# EAGLE schematic BPB_FM1 (EAGLE 9.6.2)
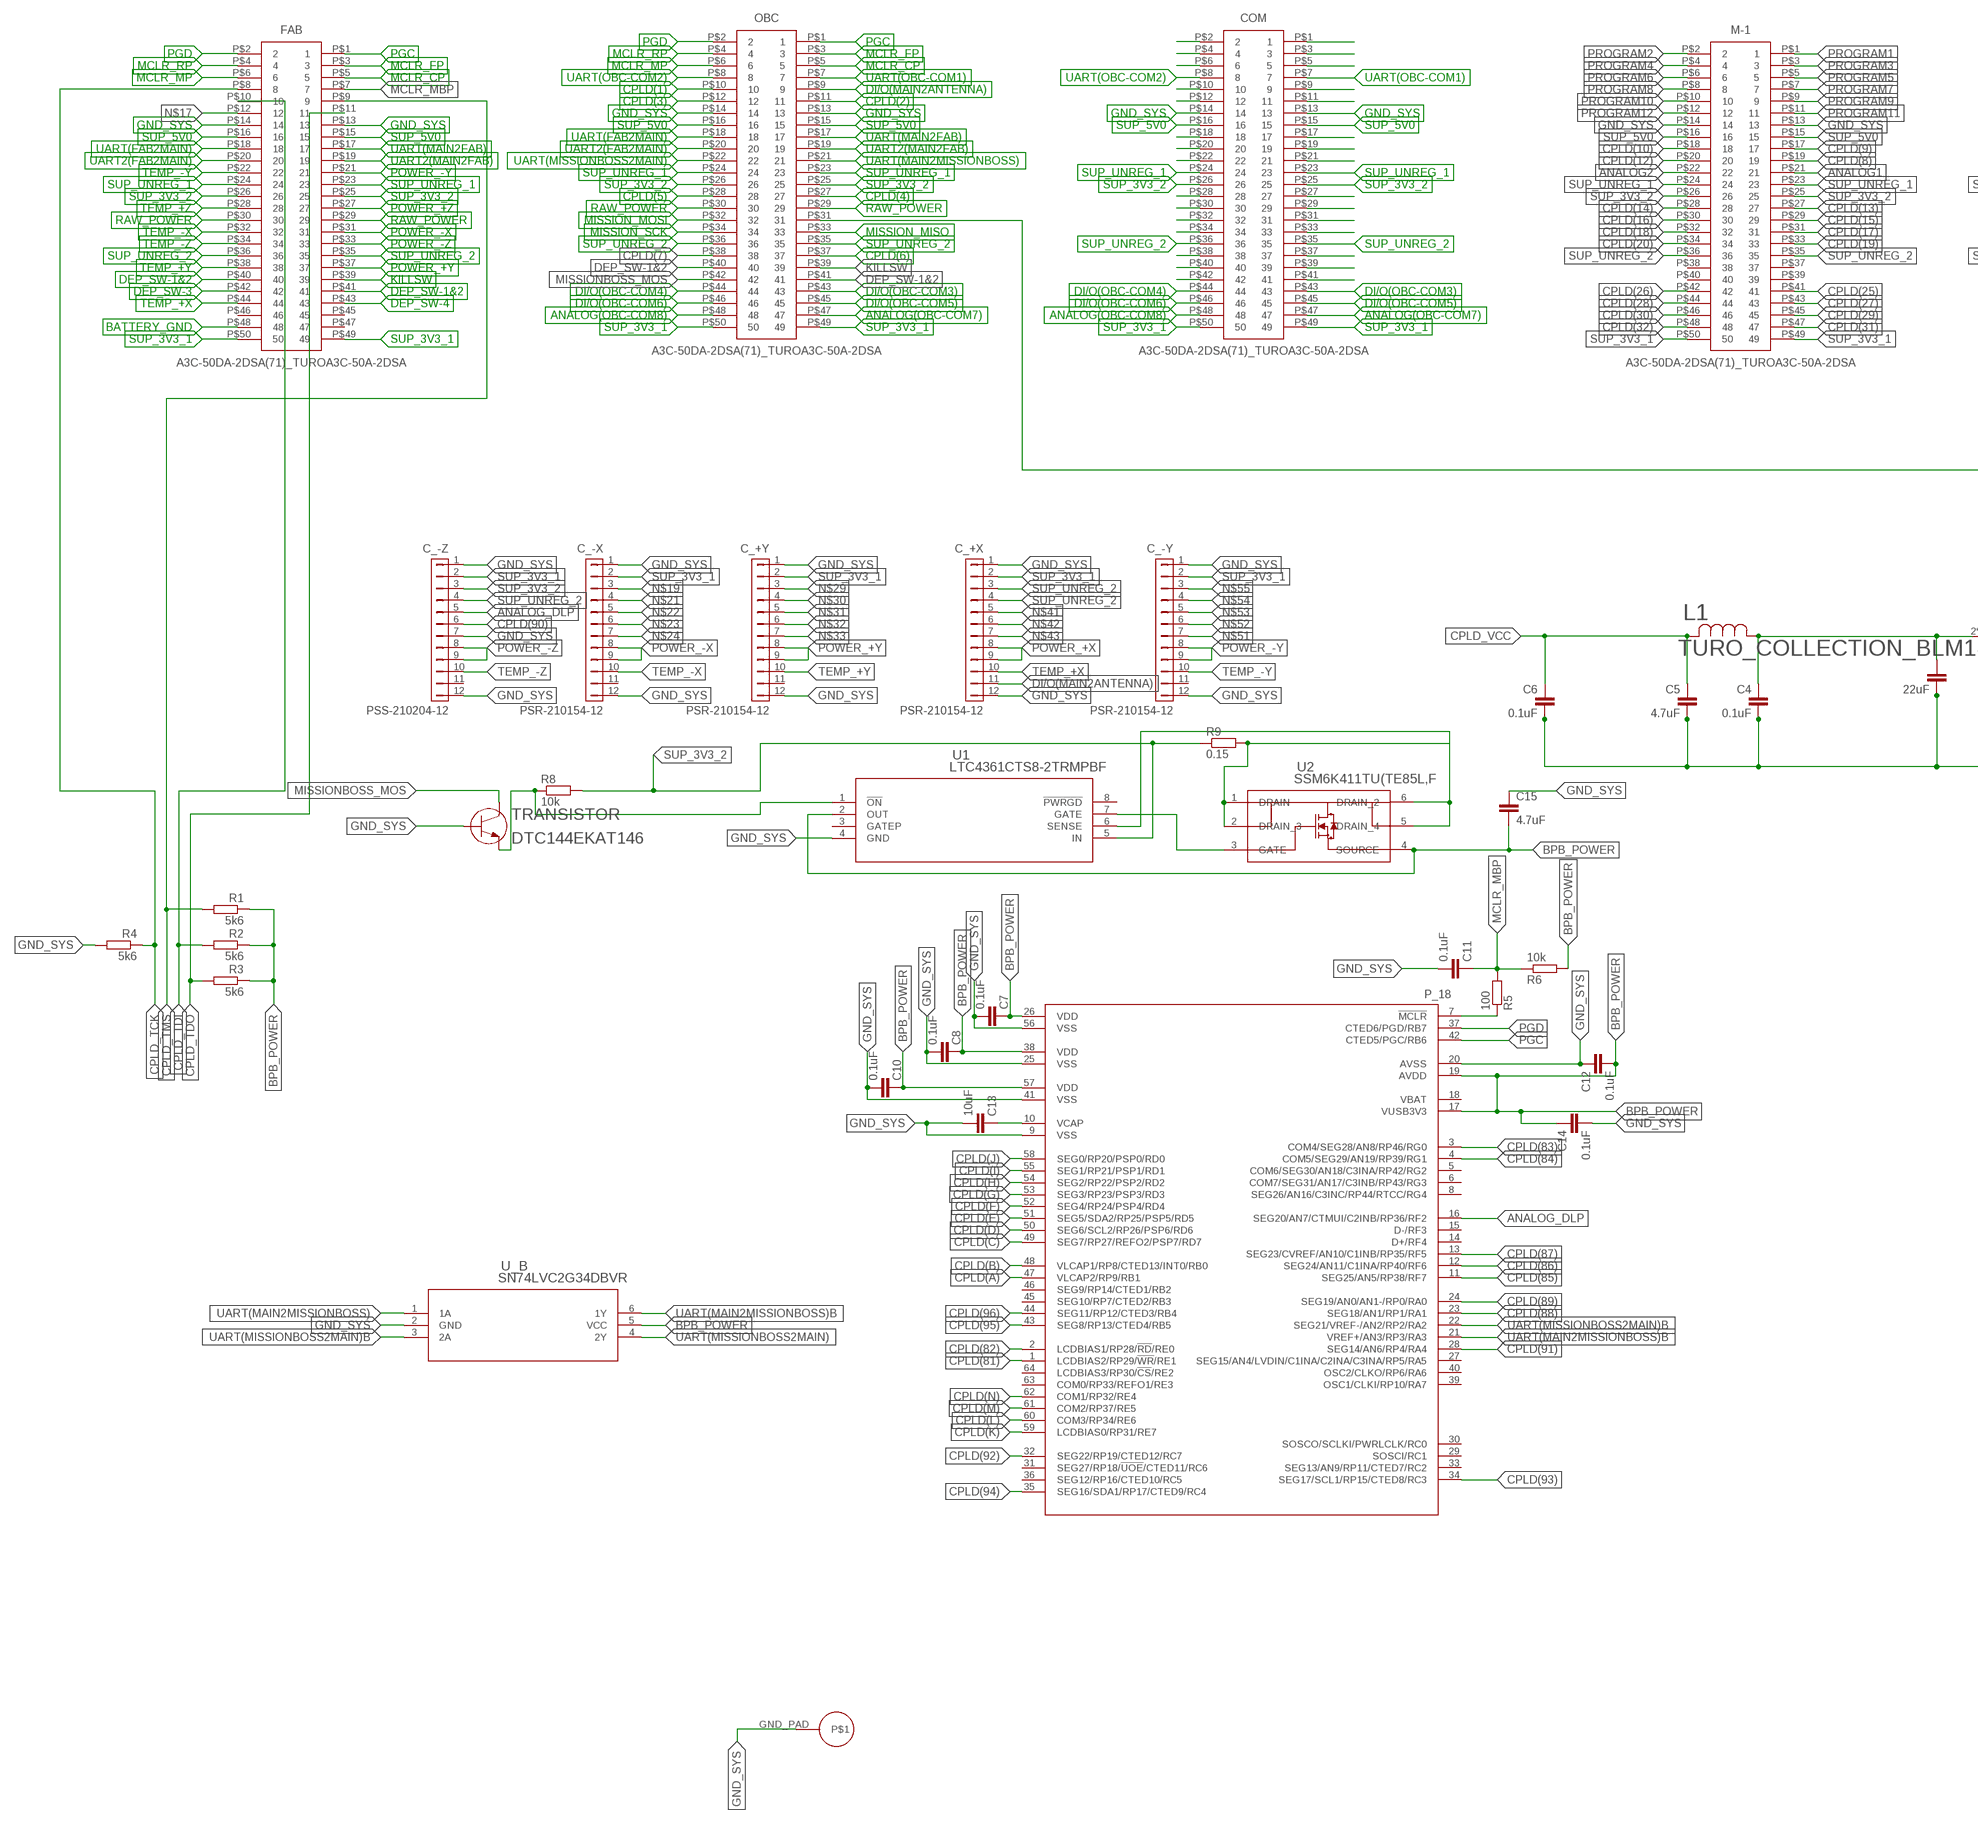
[diagram p0: schematic, sheet 1, part 1 of 2]
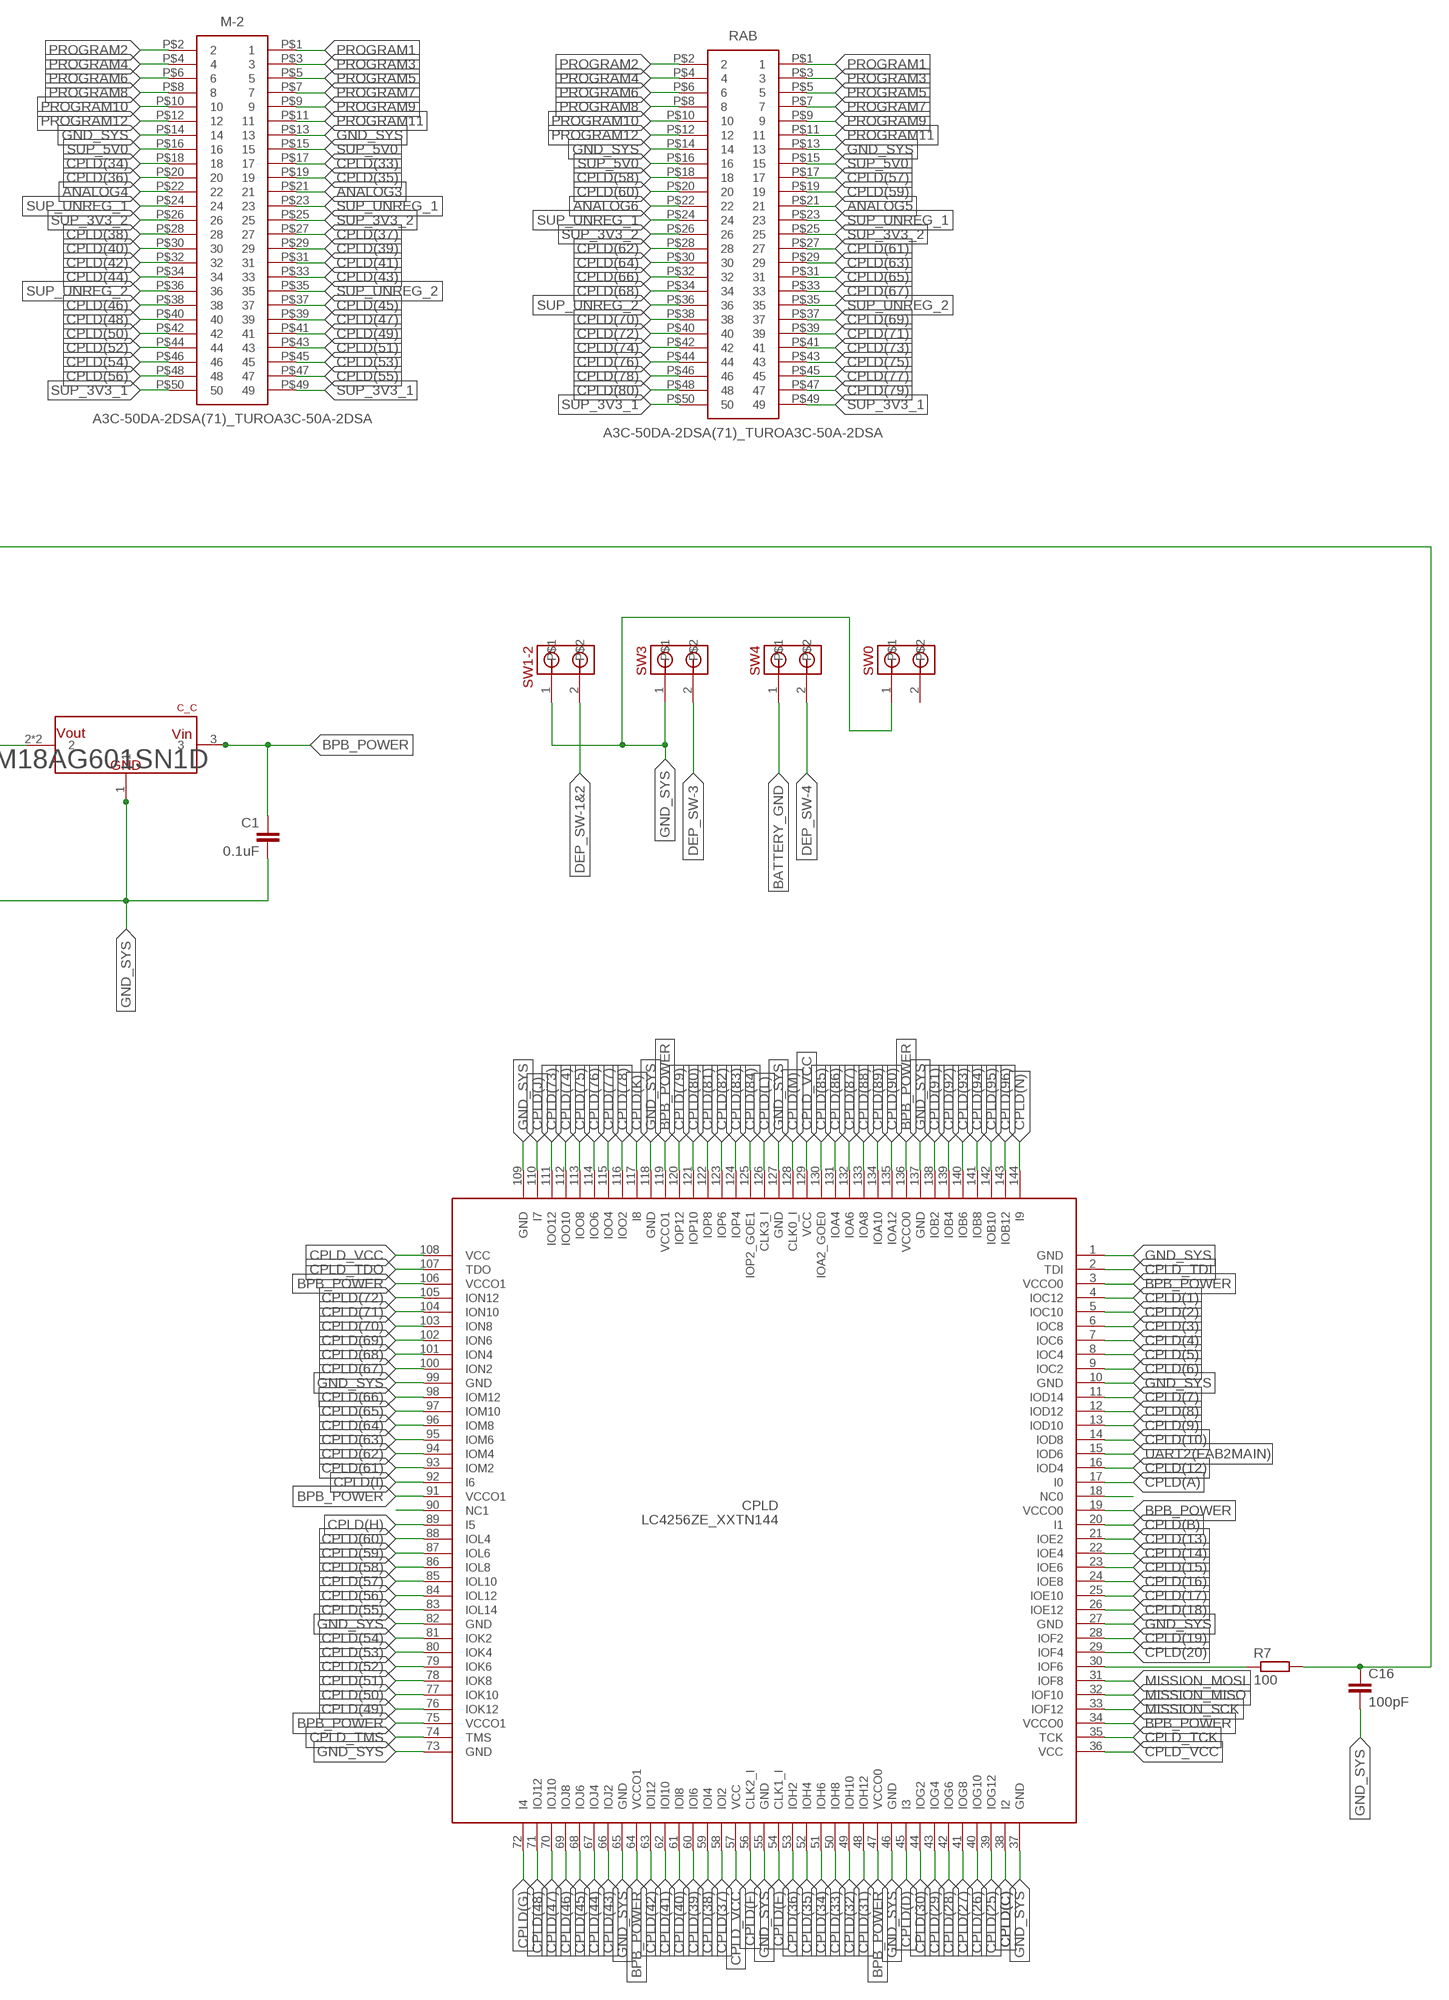
[diagram p1: schematic, sheet 1, part 2 of 2]

## Parts
C1  0.1uF  CC0402  [C0402]
C3  22uF  CC2012  [C2012]
C4  0.1uF  CC0402  [C0402]
C5  4.7uF  CC2012  [C2012]
C6  0.1uF  CC0402  [C0402]
C7  0.1uF  CC0402  [C0402]
C8  0.1uF  CC0402  [C0402]
C10  0.1uF  CC0402  [C0402]
C11  0.1uF  CC0402  [C0402]
C12  0.1uF  CC0402  [C0402]
C13  10uF  CC0402  [C0402]
C14  0.1uF  CC0402  [C0402]
C15  4.7uF  CC0402  [C0402]
C16  100pF  CC0402  [C0402]
C_+X  PSR-210154-12  [PIN1X12/90]
C_+Y  PSR-210154-12  [PIN1X12/90]
C_-X  PSR-210154-12  [PIN1X12/90]
C_-Y  PSR-210154-12  [PIN1X12/90]
C_-Z  PSS-210204-12  [PIN1X12]
C_C  NCV1117ST18T3G  [SOT223]
COM  A3C-50DA-2DSA(71)_TUROA3C-50A-2DSA  [SHDR50W60P200_2X25_5000X400X44_TR]
CPLD  LC4256ZE_XXTN144  [TQFP144]
FAB  A3C-50DA-2DSA(71)_TUROA3C-50A-2DSA  [SHDR50W60P200_2X25_5000X400X44_TR]
L1  TURO_COLLECTION_BLM18AG601SN1D  [TURO_COLLECTION_IND_BLM18_0603]
M-1  A3C-50DA-2DSA(71)_TUROA3C-50A-2DSA  [SHDR50W60P200_2X25_5000X400X44_TR]
M-2  A3C-50DA-2DSA(71)_TUROA3C-50A-2DSA  [SHDR50W60P200_2X25_5000X400X44_TR]
OBC  A3C-50DA-2DSA(71)_TUROA3C-50A-2DSA  [SHDR50W60P200_2X25_5000X400X44_TR]
P_18  PIC18F67J94  [PIC18F67J9_SMA_LEAD]
R1  5k6  RR0402  [R0402]
R2  5k6  RR0402  [R0402]
R3  5k6  RR0402  [R0402]
R4  5k6  RR0402  [R0402]
R5  100  RR0402  [R0402]
R6  10k  RR0402  [R0402]
R7  100  RR0402  [R0402]
R8  10k  RR0402  [R0402]
R9  0.15  RR0402  [R0402]
RAB  A3C-50DA-2DSA(71)_TUROA3C-50A-2DSA  [SHDR50W60P200_2X25_5000X400X44_TR]
SW0  MOLEX-CONN-2-0554600272  [MOLEX-CONN-2-BIRDS]
SW1-2  MOLEX-CONN-2-0554600272  [MOLEX-CONN-2-BIRDS]
SW3  MOLEX-CONN-2-0554600272  [MOLEX-CONN-2-BIRDS]
SW4  MOLEX-CONN-2-0554600272  [MOLEX-CONN-2-BIRDS]
TRANSISTOR  DTC144EKAT146  [TRANS_DTA113TKAT_ROM]
U1  LTC4361CTS8-2TRMPBF  [TSOT-23_TS8_LIT]
U2  SSM6K411TU(TE85L,F  [SON_E85L,F_TOS]
U$1  GND_PAD  [GND_PAD]
U_B  SN74LVC2G34DBVR  [DBV6]

## Nets
ANALOG1: M-1.P$21
ANALOG2: M-1.P$22
ANALOG3: M-2.P$21
ANALOG4: M-2.P$22
ANALOG5: RAB.P$21
ANALOG6: RAB.P$22
ANALOG(OBC-COM7): COM.P$47 OBC.P$47
ANALOG(OBC-COM8): COM.P$48 OBC.P$48
ANALOG_DLP: C_-Z.5 P_18.16(SEG20/AN7/CTMUI/C2INB/RP36/RF2)
BATTERY_GND: FAB.P$48 SW4.1
BPB_POWER: C1.1 C7.1 C8.1 C10.1 C12.2 C14.1 C15.2 C_C.3 CPLD.3(VCCO0) CPLD.19(VCCO0) CPLD.34(VCCO0) CPLD.47(VCCO0) CPLD.64(VCCO1) CPLD.75(VCCO1) CPLD.91(VCCO1) CPLD.106(VCCO1) CPLD.119(VCCO1) CPLD.136(VCCO0) P_18.17(VUSB3V3) P_18.19(AVDD) P_18.26(VDD) P_18.38(VDD) P_18.57(VDD) R1.1 R2.1 R3.1 R6.2 U1.2(OUT) U2.4(SOURCE) U_B.5(VCC)
CPLD(1): CPLD.4(IOC12) OBC.P$10
CPLD(2): CPLD.5(IOC10) OBC.P$11
CPLD(3): CPLD.6(IOC8) OBC.P$12
CPLD(4): CPLD.7(IOC6) OBC.P$27
CPLD(5): CPLD.8(IOC4) OBC.P$28
CPLD(6): CPLD.9(IOC2) OBC.P$37
CPLD(7): CPLD.11(IOD14) OBC.P$38
CPLD(8): CPLD.12(IOD12) M-1.P$19
CPLD(9): CPLD.13(IOD10) M-1.P$17
CPLD(10): CPLD.14(IOD8) M-1.P$18
CPLD(12): CPLD.16(IOD4) M-1.P$20
CPLD(13): CPLD.21(IOE2) M-1.P$27
CPLD(14): CPLD.22(IOE4) M-1.P$28
CPLD(15): CPLD.23(IOE6) M-1.P$29
CPLD(16): CPLD.24(IOE8) M-1.P$30
CPLD(17): CPLD.25(IOE10) M-1.P$31
CPLD(18): CPLD.26(IOE12) M-1.P$32
CPLD(19): CPLD.28(IOF2) M-1.P$33
CPLD(20): CPLD.29(IOF4) M-1.P$34
CPLD(25): CPLD.39(IOG12) M-1.P$41
CPLD(26): CPLD.40(IOG10) M-1.P$42
CPLD(27): CPLD.41(IOG8) M-1.P$43
CPLD(28): CPLD.42(IOG6) M-1.P$44
CPLD(29): CPLD.43(IOG4) M-1.P$45
CPLD(30): CPLD.44(IOG2) M-1.P$46
CPLD(31): CPLD.48(IOH12) M-1.P$47
CPLD(32): CPLD.49(IOH10) M-1.P$48
CPLD(33): CPLD.50(IOH8) M-2.P$17
CPLD(34): CPLD.51(IOH6) M-2.P$18
CPLD(35): CPLD.52(IOH4) M-2.P$19
CPLD(36): CPLD.53(IOH2) M-2.P$20
CPLD(37): CPLD.58(IOI2) M-2.P$27
CPLD(38): CPLD.59(IOI4) M-2.P$28
CPLD(39): CPLD.60(IOI6) M-2.P$29
CPLD(40): CPLD.61(IOI8) M-2.P$30
CPLD(41): CPLD.62(IOI10) M-2.P$31
CPLD(42): CPLD.63(IOI12) M-2.P$32
CPLD(43): CPLD.66(IOJ2) M-2.P$33
CPLD(44): CPLD.67(IOJ4) M-2.P$34
CPLD(45): CPLD.68(IOJ6) M-2.P$37
CPLD(46): CPLD.69(IOJ8) M-2.P$38
CPLD(47): CPLD.70(IOJ10) M-2.P$39
CPLD(48): CPLD.71(IOJ12) M-2.P$40
CPLD(49): CPLD.76(IOK12) M-2.P$41
CPLD(50): CPLD.77(IOK10) M-2.P$42
CPLD(51): CPLD.78(IOK8) M-2.P$43
CPLD(52): CPLD.79(IOK6) M-2.P$44
CPLD(53): CPLD.80(IOK4) M-2.P$45
CPLD(54): CPLD.81(IOK2) M-2.P$46
CPLD(55): CPLD.83(IOL14) M-2.P$47
CPLD(56): CPLD.84(IOL12) M-2.P$48
CPLD(57): CPLD.85(IOL10) RAB.P$17
CPLD(58): CPLD.86(IOL8) RAB.P$18
CPLD(59): CPLD.87(IOL6) RAB.P$19
CPLD(60): CPLD.88(IOL4) RAB.P$20
CPLD(61): CPLD.93(IOM2) RAB.P$27
CPLD(62): CPLD.94(IOM4) RAB.P$28
CPLD(63): CPLD.95(IOM6) RAB.P$29
CPLD(64): CPLD.96(IOM8) RAB.P$30
CPLD(65): CPLD.97(IOM10) RAB.P$31
CPLD(66): CPLD.98(IOM12) RAB.P$32
CPLD(67): CPLD.100(ION2) RAB.P$33
CPLD(68): CPLD.101(ION4) RAB.P$34
CPLD(69): CPLD.102(ION6) RAB.P$37
CPLD(70): CPLD.103(ION8) RAB.P$38
CPLD(71): CPLD.104(ION10) RAB.P$39
CPLD(72): CPLD.105(ION12) RAB.P$40
CPLD(73): CPLD.111(IOO12) RAB.P$41
CPLD(74): CPLD.112(IOO10) RAB.P$42
CPLD(75): CPLD.113(IOO8) RAB.P$43
CPLD(76): CPLD.114(IOO6) RAB.P$44
CPLD(77): CPLD.115(IOO4) RAB.P$45
CPLD(78): CPLD.116(IOO2) RAB.P$46
CPLD(79): CPLD.120(IOP12) RAB.P$47
CPLD(80): CPLD.121(IOP10) RAB.P$48
CPLD(81): CPLD.122(IOP8) P_18.1(LCDBIAS2/RP29/!WR!/RE1)
CPLD(82): CPLD.123(IOP6) P_18.2(LCDBIAS1/RP28/!RD!/RE0)
CPLD(83): CPLD.124(IOP4) P_18.3(COM4/SEG28/AN8/RP46/RG0)
CPLD(84): CPLD.125(IOP2_GOE1) P_18.4(COM5/SEG29/AN19/RP39/RG1)
CPLD(85): CPLD.130(IOA2_GOE0) P_18.11(SEG25/AN5/RP38/RF7)
CPLD(86): CPLD.131(IOA4) P_18.12(SEG24/AN11/C1INA/RP40/RF6)
CPLD(87): CPLD.132(IOA6) P_18.13(SEG23/CVREF/AN10/C1INB/RP35/RF5)
CPLD(88): CPLD.133(IOA8) P_18.23(SEG18/AN1/RP1/RA1)
CPLD(89): CPLD.134(IOA10) P_18.24(SEG19/AN0/AN1-/RP0/RA0)
CPLD(90): C_-Z.6 CPLD.135(IOA12)
CPLD(91): CPLD.138(IOB2) P_18.28(SEG14/AN6/RP4/RA4)
CPLD(92): CPLD.139(IOB4) P_18.32(SEG22/RP19/CTED12/RC7)
CPLD(93): CPLD.140(IOB6) P_18.34(SEG17/SCL1/RP15/CTED8/RC3)
CPLD(94): CPLD.141(IOB8) P_18.35(SEG16/SDA1/RP17/CTED9/RC4)
CPLD(95): CPLD.142(IOB10) P_18.43(SEG8/RP13/CTED4/RB5)
CPLD(96): CPLD.143(IOB12) P_18.44(SEG11/RP12/CTED3/RB4)
CPLD(A): CPLD.17(I0) P_18.47(VLCAP2/RP9/RB1)
CPLD(B): CPLD.20(I1) P_18.48(VLCAP1/RP8/CTED13/INT0/RB0)
CPLD(C): CPLD.38(I2) P_18.49(SEG7/RP27/REFO2/PSP7/RD7)
CPLD(D): CPLD.45(I3) P_18.50(SEG6/SCL2/RP26/PSP6/RD6)
CPLD(E): CPLD.54(CLK1_I) P_18.51(SEG5/SDA2/RP25/PSP5/RD5)
CPLD(F): CPLD.56(CLK2_I) P_18.52(SEG4/RP24/PSP4/RD4)
CPLD(G): CPLD.72(I4) P_18.53(SEG3/RP23/PSP3/RD3)
CPLD(H): CPLD.89(I5) P_18.54(SEG2/RP22/PSP2/RD2)
CPLD(I): CPLD.92(I6) P_18.55(SEG1/RP21/PSP1/RD1)
CPLD(J): CPLD.110(I7) P_18.58(SEG0/RP20/PSP0/RD0)
CPLD(K): CPLD.117(I8) P_18.59(LCDBIAS0/RP31/RE7)
CPLD(L): CPLD.126(CLK3_I) P_18.60(COM3/RP34/RE6)
CPLD(M): CPLD.128(CLK0_I) P_18.61(COM2/RP37/RE5)
CPLD(N): CPLD.144(I9) P_18.62(COM1/RP32/RE4)
CPLD_TCK: CPLD.35(TCK) FAB.P$8 R4.1
CPLD_TDI: CPLD.2(TDI) FAB.P$10 R2.2
CPLD_TDO: CPLD.107(TDO) FAB.P$11 R3.2
CPLD_TMS: CPLD.74(TMS) FAB.P$9 R1.2
CPLD_VCC: C5.1 C6.1 CPLD.36(VCC) CPLD.57(VCC) CPLD.108(VCC) CPLD.129(VCC) L1.2
DEP_SW-1&2: FAB.P$40 FAB.P$41 OBC.P$40 OBC.P$41 SW1-2.2
DEP_SW-3: FAB.P$42 SW3.2
DEP_SW-4: FAB.P$43 SW4.2
DI/O(MAIN2ANTENNA): C_+X.11 OBC.P$9
DI/O(OBC-COM3): COM.P$43 OBC.P$43
DI/O(OBC-COM4): COM.P$44 OBC.P$44
DI/O(OBC-COM5): COM.P$45 OBC.P$45
DI/O(OBC-COM6): COM.P$46 OBC.P$46
GND_SYS: C1.2 C3.2 C4.2 C5.2 C6.2 C7.2 C8.2 C10.2 C11.2 C12.1 C13.2 C14.2 C15.1 C16.2 C_+X.1 C_+X.12 C_+Y.1 C_+Y.12 C_-X.1 C_-X.12 C_-Y.1 C_-Y.12 C_-Z.1 C_-Z.7 C_-Z.12 C_C.1 COM.P$13 COM.P$14 CPLD.1(GND) CPLD.10(GND) CPLD.27(GND) CPLD.37(GND) CPLD.46(GND) CPLD.55(GND) CPLD.65(GND) CPLD.73(GND) CPLD.82(GND) CPLD.99(GND) CPLD.109(GND) CPLD.118(GND) CPLD.127(GND) CPLD.137(GND) FAB.P$13 FAB.P$14 M-1.P$13 M-1.P$14 M-2.P$13 M-2.P$14 OBC.P$13 OBC.P$14 P_18.9(VSS) P_18.20(AVSS) P_18.25(VSS) P_18.41(VSS) P_18.56(VSS) R4.2 RAB.P$13 RAB.P$14 SW0.1 SW1-2.1 SW3.1 TRANSISTOR.2 U1.4(GND) U$1.GND_PAD U_B.2(GND)
KILLSW: FAB.P$39 OBC.P$39
MCLR_CP: FAB.P$5 OBC.P$5
MCLR_FP: FAB.P$3 OBC.P$3
MCLR_MBP: C11.1 FAB.P$7 R5.2 R6.1
MCLR_MP: FAB.P$6 OBC.P$6
MCLR_RP: FAB.P$4 OBC.P$4
MISSION_CS: C16.1 OBC.P$31 R7.2
MISSION_MISO: CPLD.32(IOF10) OBC.P$33
MISSION_MOSI: CPLD.31(IOF8) OBC.P$32
MISSION_SCK: CPLD.33(IOF12) OBC.P$34
MISSIONBOSS_MOS: OBC.P$42 TRANSISTOR.1
N$1: P_18.7(!MCLR!) R5.1
N$2: CPLD.30(IOF6) R7.1
N$3: R8.1 TRANSISTOR.3 U1.1(!ON)
N$5: R9.2 U1.6(SENSE) U2.1(DRAIN) U2.2(DRAIN_3) U2.5(DRAIN_4) U2.6(DRAIN_2)
N$6: C13.1 P_18.10(VCAP)
N$9: U1.7(GATE) U2.3(GATE)
N$17: FAB.P$12
N$19: C_-X.3
N$20: C3.1 C4.1 C_C.2 C_C.4 L1.1
N$21: C_-X.4
N$22: C_-X.5
N$23: C_-X.6
N$24: C_-X.7
N$29: C_+Y.3
N$30: C_+Y.4
N$31: C_+Y.5
N$32: C_+Y.6
N$33: C_+Y.7
N$34: CPLD.18(NC0)
N$41: C_+X.5
N$42: C_+X.6
N$43: C_+X.7
N$51: C_-Y.7
N$52: C_-Y.6
N$53: C_-Y.5
N$54: C_-Y.4
N$55: C_-Y.3
N$98: COM.P$2
N$99: COM.P$4
N$100: COM.P$6
N$102: COM.P$10
N$103: COM.P$12
N$106: COM.P$18
N$107: COM.P$20
N$108: COM.P$22
N$111: COM.P$28
N$112: COM.P$30
N$113: COM.P$32
N$114: COM.P$34
N$116: COM.P$38
N$117: COM.P$40
N$118: COM.P$42
N$123: COM.P$1
N$124: COM.P$3
N$125: COM.P$5
N$127: COM.P$9
N$128: COM.P$11
N$131: COM.P$17
N$132: COM.P$19
N$133: COM.P$21
N$136: COM.P$27
N$137: COM.P$29
N$138: COM.P$31
N$139: COM.P$33
N$140: CPLD.90(NC1)
N$141: COM.P$37
N$142: COM.P$39
N$143: COM.P$41
PGC: FAB.P$1 OBC.P$1 P_18.42(CTED5/PGC/RB6)
PGD: FAB.P$2 OBC.P$2 P_18.37(CTED6/PGD/RB7)
POWER_+X: C_+X.8 C_+X.9
POWER_+Y: C_+Y.8 C_+Y.9 FAB.P$37
POWER_+Z: FAB.P$27
POWER_-X: C_-X.8 C_-X.9 FAB.P$31
POWER_-Y: C_-Y.8 C_-Y.9 FAB.P$21
POWER_-Z: C_-Z.8 C_-Z.9 FAB.P$33
PROGRAM1: M-1.P$1 M-2.P$1 RAB.P$1
PROGRAM2: M-1.P$2 M-2.P$2 RAB.P$2
PROGRAM3: M-1.P$3 M-2.P$3 RAB.P$3
PROGRAM4: M-1.P$4 M-2.P$4 RAB.P$4
PROGRAM5: M-1.P$5 M-2.P$5 RAB.P$5
PROGRAM6: M-1.P$6 M-2.P$6 RAB.P$6
PROGRAM7: M-1.P$7 M-2.P$7 RAB.P$7
PROGRAM8: M-1.P$8 M-2.P$8 RAB.P$8
PROGRAM9: M-1.P$9 M-2.P$9 RAB.P$9
PROGRAM10: M-1.P$10 M-2.P$10 RAB.P$10
PROGRAM11: M-1.P$11 M-2.P$11 RAB.P$11
PROGRAM12: M-1.P$12 M-2.P$12 RAB.P$12
RAW_POWER: FAB.P$29 FAB.P$30 OBC.P$29 OBC.P$30
SUP_3V3_1: C_+X.2 C_+Y.2 C_-X.2 C_-Y.2 C_-Z.2 COM.P$49 COM.P$50 FAB.P$49 FAB.P$50 M-1.P$49 M-1.P$50 M-2.P$49 M-2.P$50 OBC.P$49 OBC.P$50 RAB.P$49 RAB.P$50
SUP_3V3_2: C_-Z.3 COM.P$25 COM.P$26 FAB.P$25 FAB.P$26 M-1.P$25 M-1.P$26 M-2.P$25 M-2.P$26 OBC.P$25 OBC.P$26 R8.2 R9.1 RAB.P$25 RAB.P$26 U1.5(IN)
SUP_5V0: COM.P$15 COM.P$16 FAB.P$15 FAB.P$16 M-1.P$15 M-1.P$16 M-2.P$15 M-2.P$16 OBC.P$15 OBC.P$16 RAB.P$15 RAB.P$16
SUP_UNREG_1: COM.P$23 COM.P$24 FAB.P$23 FAB.P$24 M-1.P$23 M-1.P$24 M-2.P$23 M-2.P$24 OBC.P$23 OBC.P$24 RAB.P$23 RAB.P$24
SUP_UNREG_2: C_+X.3 C_+X.4 C_-Z.4 COM.P$35 COM.P$36 FAB.P$35 FAB.P$36 M-1.P$35 M-1.P$36 M-2.P$35 M-2.P$36 OBC.P$35 OBC.P$36 RAB.P$35 RAB.P$36
TEMP_+X: C_+X.10 FAB.P$44
TEMP_+Y: C_+Y.10 FAB.P$38
TEMP_+Z: FAB.P$28
TEMP_-X: C_-X.10 FAB.P$32
TEMP_-Y: C_-Y.10 FAB.P$22
TEMP_-Z: C_-Z.10 FAB.P$34
UART2(FAB2MAIN): CPLD.15(IOD6) FAB.P$20 OBC.P$20
UART2(MAIN2FAB): FAB.P$19 OBC.P$19
UART(FAB2MAIN): FAB.P$18 OBC.P$18
UART(MAIN2FAB): FAB.P$17 OBC.P$17
UART(MAIN2MISSIONBOSS): OBC.P$21 U_B.1(1A)
UART(MAIN2MISSIONBOSS)B: P_18.21(VREF+/AN3/RP3/RA3) U_B.6(1Y)
UART(MISSIONBOSS2MAIN): OBC.P$22 U_B.4(2Y)
UART(MISSIONBOSS2MAIN)B: P_18.22(SEG21/VREF-/AN2/RP2/RA2) U_B.3(2A)
UART(OBC-COM1): COM.P$7 OBC.P$7
UART(OBC-COM2): COM.P$8 OBC.P$8
Unconnected: C_+Y.11 C_-X.11 C_-Y.11 C_-Z.11 FAB.P$45 FAB.P$46 FAB.P$47 M-1.P$37 M-1.P$38 M-1.P$39 M-1.P$40 P_18.5(COM6/SEG30/AN18/C3INA/RP42/RG2) P_18.6(COM7/SEG31/AN17/C3INB/RP43/RG3) P_18.8(SEG26/AN16/C3INC/RP44/RTCC/RG4) P_18.14(D+/RF4) P_18.15(D-/RF3) P_18.18(VBAT) P_18.27(SEG15/AN4/LVDIN/C1INA/C2INA/C3INA/RP5/RA5) P_18.29(SOSCI/RC1) P_18.30(SOSCO/SCLKI/PWRLCLK/RC0) P_18.31(SEG27/RP18/!UOE!/CTED11/RC6) P_18.33(SEG13/AN9/RP11/CTED7/RC2) P_18.36(SEG12/RP16/CTED10/RC5) P_18.39(OSC1/CLKI/RP10/RA7) P_18.40(OSC2/CLKO/RP6/RA6) P_18.45(SEG10/RP7/CTED2/RB3) P_18.46(SEG9/RP14/CTED1/RB2) P_18.63(COM0/RP33/REFO1/RE3) P_18.64(LCDBIAS3/RP30/!CS!/RE2) SW0.2 U1.3(GATEP) U1.8(!PWRGD)

## Library data of the parts
C1 C3-C8 C10-C16 = Turo_collection_05102018:C: CAPACITOR, European symbol; SPICEMODEL: NONE; SPICEPREFIX: C
C_+X C_+Y C_-X C_-Y = Turo_collection_05102018:PSR-210154-12
C_-Z = Turo_collection_05102018:PSS-210204-12: Used for -Z panel on the backplane Created by Turo - 2018
C_C = Turo_collection_05102018:NCV1117ST18T3G: Linear Voltage Regulator IC Positive Fixed 1 Output 1.8V 1A SOT-223 https://www.digikey.com/product-detail/en/on-semiconductor/NCV1117ST18T3G/NCV1117ST18T3GOSCT-ND/3487436
COM FAB M-1 M-2 OBC RAB = Turo_collection_05102018:A3C-50DA-2DSA(71)_TURO: Hirose A3C Series 2mm 50 Way 2 Row Straight PCB Socket Through Hole Board to Wire <http://uk.rs-online.com/largeimages/R7793068-01.jpg> Source: Datasheet <https://www.google.co.uk/url?sa=t&rct=j&q=&esrc=s&source=web&cd=5&ved=0ahUKEwiW7Ov7l8PWAhUDCsAKHbxmCjsQFgg9MAQ&url=https://www.hirose.com/product/en/download_file/key_name/A3/category/Catalog/doc_file_id/49521/?file_category_id>
CPLD = Turo_collection_05102018:LC4256ZE_XXTN144: ispMACH 4256ZE TQFP144 Lattice Semiconductor Corporation - ispMACH 4000ZE Ultra Low Power, Low Cost CPLD Family Generated using Lattice BSDL models: http://www.latticesemi.com/dynamic/index.cfm?fuseaction=view_documents&document_type=36&sloc=01-01-02-01&source=sidebar
L1 = SBPB_FM_v2.3:TURO_COLLECTION_BLM18AG601SN1D: BLM18AG601SN1D FERRITE BEAD 600 OHM 0603 1LN Murata Electronics North America Datasheet: https://www.murata.com/en-us/products/productdata/8796738650142/ENFA0003.pdf; MANUFACTURER_PART_NUMBER: BLM18AG601SN1D; VENDOR: MURATA
P_18 = pic18f67j94:PIC18F67J94
R1-R9 = Turo_collection_05102018:R: RESISTOR, European symbol; SPICEMODEL: NONE; SPICEPREFIX: R
SW0 SW1-2 SW3 SW4 = Turo_collection_05102018:MOLEX-CONN-2-0554600272
TRANSISTOR = DTC144EKA146:DTC144EKAT146; BUILT_BY: EMA_Matt; COPYRIGHT: Copyright (C) 2018 Accelerated Designs. All rights reserved; MANUFACTURER_PART_NUMBER: DTC144EKAT146; SOURCELIBRARY: Rohm_2019-09-23; VENDOR: ROHM Semiconductor
U1 = LTC4361CTS8-2TRMPBF:LTC4361CTS8-2TRMPBF; BUILT_BY: EMA_UL_Team; MANUFACTURER_PART_NUMBER: LTC4361CTS8-2#TRMPBF; SOURCELIBRARY: LinearTech_2016-05-13_4; VENDOR: Linear Technology
U2 = SSM6K411TU:SSM6K411TU(TE85L,F; BUILT_BY: EMA_Matt; COPYRIGHT: Copyright (C) 2018 Accelerated Designs. All rights reserved; DATASHEET: https://www.digikey.com/en/products/detail/toshiba-semiconductor-and-storage/SSM6K411TU-TE85LF/5299193; MANUFACTURER_PART_NUMBER: SSM6K411TU(TE85L,F; SOURCELIBRARY: Add_to_database_2021-04-29; VENDOR: Toshiba
U$1 = Turo_collection_05102018:GND_PAD
U_B = SN74LVC2G34DBVR:SN74LVC2G34DBVR; DATASHEET_URL: http://www.ti.com/lit/gpn/SN74LVC2G34; DESCRIPTION: Dual Buffer Gate; FAMILY_NAME: LL BUFFER GATE; GENERIC_PART_NUMBER: SN74LVC2G34; INDUSTRY_STD_PKG_TYPE: SOT-23; MANUFACTURER: Texas Instruments; MANUFACTURER_PART_NUMBER: SN74LVC2G34DBVR; PACKAGE_DESIGNATOR: DBV; PIN_COUNT: 6; VENDOR: Texas Instruments

## Net classes
3 SUP_UNREG: width 1.27 mm